# Altium project MEGA2560_Rev3e.PrjPcb
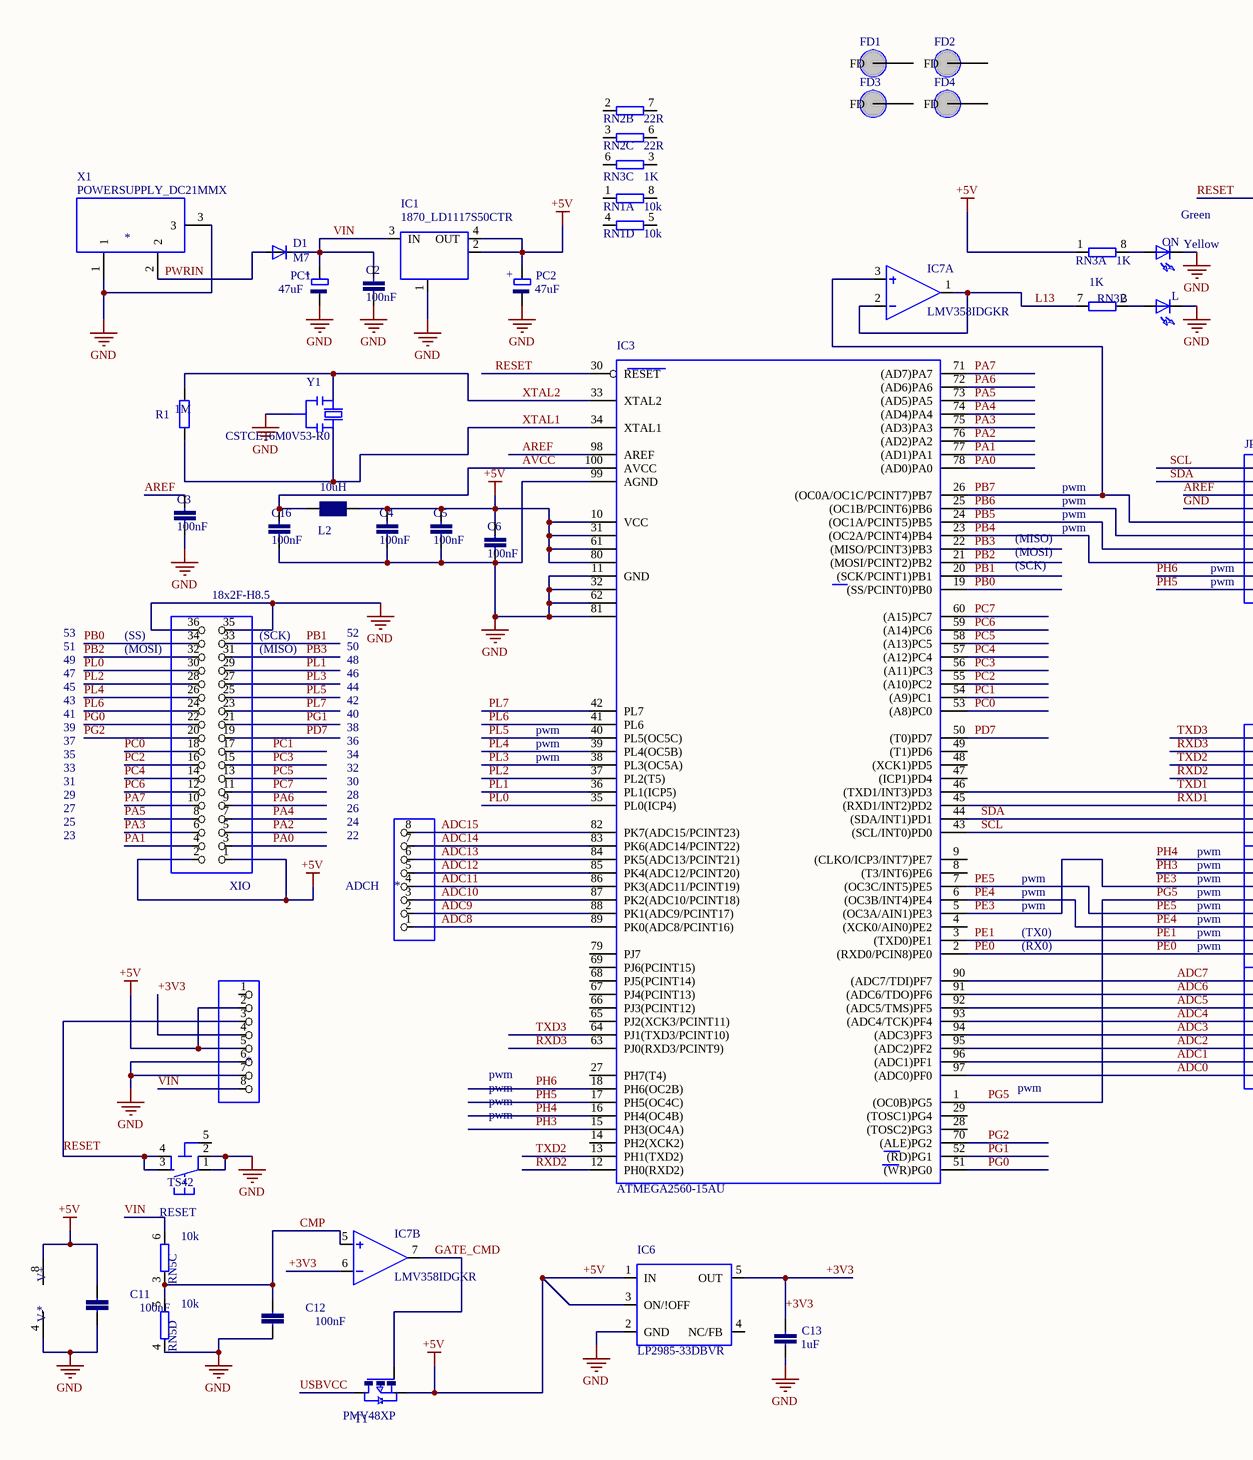
[diagram p0: MEGA2560_Rev3e_1.SchDoc, left]
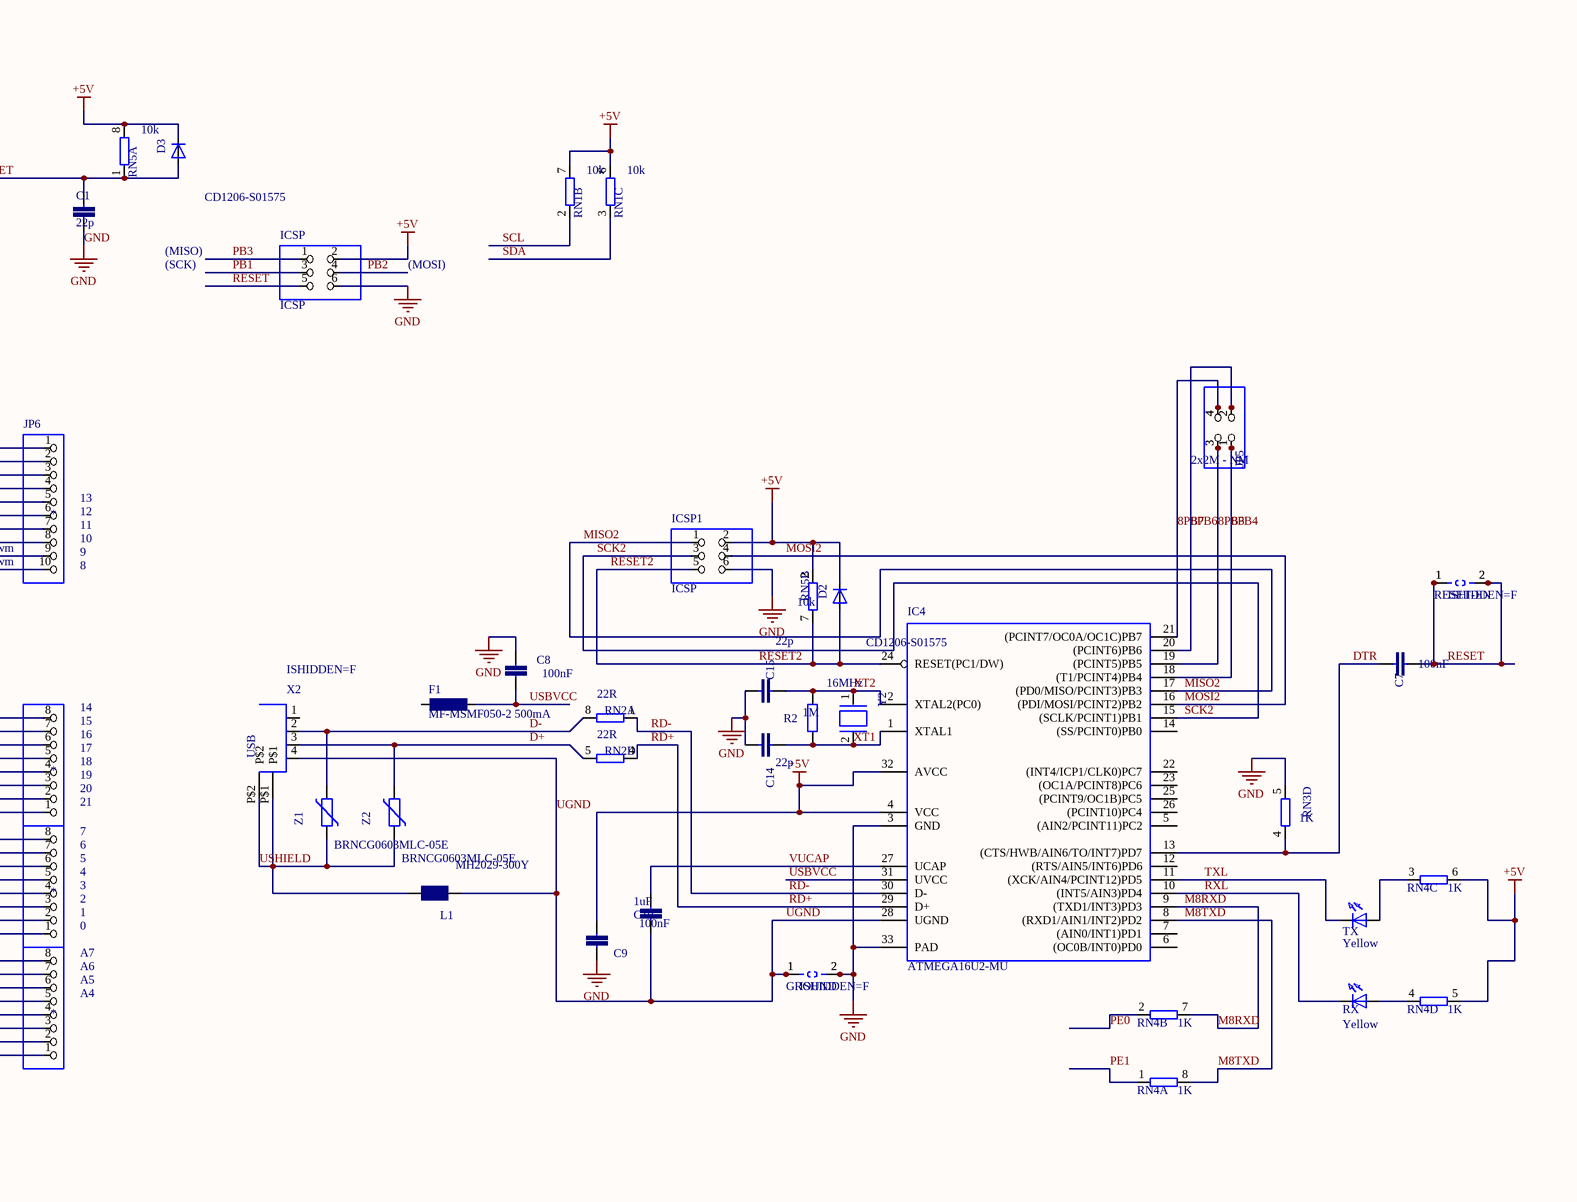
[diagram p1: MEGA2560_Rev3e_1.SchDoc, right]
1 sheet, 64 parts. Net scope: global (net labels, ports and power ports of the same name join across sheets).

## Sheet MEGA2560_Rev3e_1.SchDoc
size A2

### Parts
ADCH  *  [1X08]
ADCL  *  [1X08]
C1  22p  [C0603-ROUND]
C2  100nF  [C0603-ROUND]
C3  100nF  [C0603-ROUND]
C4  100nF  [C0603-ROUND]
C5  100nF  [C0603-ROUND]
C6  100nF  [C0603-ROUND]
C7  100nF  [C0603-ROUND]
C8  100nF  [C0603-ROUND]
C9  100nF  [C0603-ROUND]
C10  1uF  [C0603-ROUND]
C11  100nF  [C0603-ROUND]
C12  100nF  [C0603-ROUND]
C13  1uF  [C0603-ROUND]
C14  22p  [C0603-ROUND]
C15  22p  [C0603-ROUND]
C16  100nF  [C0603-ROUND]
COMMUNICATION  *  [1X08]
D1  M7  [SMB]
D2  CD1206-S01575  [MINIMELF]
D3  CD1206-S01575  [MINIMELF]
F1  MF-MSMF050-2 500mA  [L1812]
FD1  FIDUCIALMOUNT  [FIDUCIA-MOUNT]  (value not drawn)
FD2  FIDUCIALMOUNT  [FIDUCIA-MOUNT]  (value not drawn)
FD3  FIDUCIALMOUNT  [FIDUCIA-MOUNT]  (value not drawn)
FD4  FIDUCIALMOUNT  [FIDUCIA-MOUNT]  (value not drawn)
GROUND  ISHIDDEN=F  [SJ]
IC1  1870_LD1117S50CTR  [LINEAR_SOT223]
IC3  ATMEGA2560-15AU  [TQFP100]
IC4  ATMEGA16U2-MU  [MLF32]
IC6  LP2985-33DBVR  [SOT23-DBV]
IC7  LMV358IDGKR  [MSOP08]  (parts A,B,C of 3)
ICSP  ICSP  [2X03]
ICSP1  ICSP  [2X03]
JP5  2x2M - NM  [2X02]
JP6  *  [1X10]
L  Yellow  [CHIPLED_0805]
L1  MH2029-300Y  [0805]
L2  10uH  [0805]
ON  Green  [CHIPLED_0805]
PC1  47uF  [PANASONIC_D]
PC2  47uF  [PANASONIC_D]
POWER  *  [1X08]
PWML  *  [1X08]
R1  1M  [R0603-ROUND]
R2  1M  [R0603-ROUND]
RESET  TS42  [TS42]
RESET-EN  ISHIDDEN=F  [SJ]
RN1  10k  [CAY16]  (parts A,B,C,D of 4)
RN2  22R  [CAY16]  (parts A,B,C,D of 4)
RN3  1K  [CAY16]  (parts A,B,C,D of 4)
RN4  1K  [CAY16]  (parts A,B,C,D of 4)
RN5  10k  [CAY16]  (parts A,B,C,D of 4)
RX  Yellow  [CHIPLED_0805]
T1  PMV48XP  [SOT-23]
TX  Yellow  [CHIPLED_0805]
X1  *  [POWERSUPPLY_DC-21MM]
X2  ISHIDDEN=F  [PN61729]
XIO  18x2F-H8.5  [2X18]
Y1  CSTCE16M0V53-R0  [RESONATOR]
Y2  16MHz  [QS]
Z1  BRNCG0603MLC-05E  [CT/CN0603]
Z2  BRNCG0603MLC-05E  [CT/CN0603]

### Nets
+5V: C4.1 C5.1 C6.1 C9.1 C11.2 D2.C D3.C IC1.2(OUT@1) IC1.4(OUT) IC3.10(VCC) IC3.31(VCC1) IC3.61(VCC2) IC3.80(VCC3) IC4.4(VCC) IC4.32(AVCC) IC6.1(IN) IC6.3(ON/!OFF) IC7.8(V+) ICSP.2 ICSP1.2 L2.2 PC2.+ POWER.2 POWER.5 RN1.6 RN1.7 RN3.1 RN4.5 RN4.6 RN5.2 RN5.8 T1.2(S) XIO.1 XIO.2
GND: C1.2 C2.2 C3.2 C4.2 C5.2 C6.2 C8.2 C9.2 C11.1 C12.1 C13.1 C14.2 C15.2 C16.2 GROUND.2 IC1.1(GND/ADJ) IC3.11(GND) IC3.32(GND1) IC3.62(GND2) IC3.81(GND3) IC3.99(AGND) IC4.3(GND) IC4.33(PAD) IC6.2(GND) IC7.4(V-) ICSP.6 ICSP1.6 JP6.4 L.C ON.C PC1.- PC2.- POWER.6 POWER.7 RESET.1 RESET.2 RN3.5 RN5.4 X1.1 X1.3 XIO.35 XIO.36 Y1.2
8PB4: IC4.18((T1/PCINT4)PB4) JP5.1
8PB5: IC4.19((PCINT5)PB5) JP5.3
8PB6: IC4.20((PCINT6)PB6) JP5.2
8PB7: IC4.21((PCINT7/OC0A/OC1C)PB7) JP5.4
+3V3: C13.2 IC6.5(OUT) IC7.6(-IN) POWER.4
ADC0: ADCL.1 IC3.97((ADC0)PF0)
ADC1: ADCL.2 IC3.96((ADC1)PF1)
ADC2: ADCL.3 IC3.95((ADC2)PF2)
ADC3: ADCL.4 IC3.94((ADC3)PF3)
ADC4: ADCL.5 IC3.93((ADC4/TCK)PF4)
ADC5: ADCL.6 IC3.92((ADC5/TMS)PF5)
ADC6: ADCL.7 IC3.91((ADC6/TDO)PF6)
ADC7: ADCL.8 IC3.90((ADC7/TDI)PF7)
ADC8: ADCH.1 IC3.89(PK0(ADC8/PCINT16))
ADC9: ADCH.2 IC3.88(PK1(ADC9/PCINT17))
ADC10: ADCH.3 IC3.87(PK2(ADC10/PCINT18))
ADC11: ADCH.4 IC3.86(PK3(ADC11/PCINT19))
ADC12: ADCH.5 IC3.85(PK4(ADC12/PCINT20))
ADC13: ADCH.6 IC3.84(PK5(ADC13/PCINT21))
ADC14: ADCH.7 IC3.83(PK6(ADC14/PCINT22))
ADC15: ADCH.8 IC3.82(PK7(ADC15/PCINT23))
AREF: C3.1 IC3.98(AREF) JP6.3
AVCC: C16.1 IC3.100(AVCC) L2.1
CMP: C12.2 IC7.5(+IN) RN5.3 RN5.5
D+: RN2.5 X2.3 Z2.2
D-: RN2.8 X2.2 Z1.2
DTR: C7.1 IC4.13((CTS/HWB/AIN6/TO/INT7)PD7) RN3.4
GATE_CMD: IC7.7(OUT) T1.3(G)
L13: IC7.1(OUT) IC7.2(-IN) RN3.7
M8RXD: IC4.9((TXD1/INT3)PD3) RN4.7
M8TXD: IC4.8((RXD1/AIN1/INT2)PD2) RN4.8
MISO2: IC4.17((PD0/MISO/PCINT3)PB3) ICSP1.1
MOSI2: IC4.16((PDI/MOSI/PCINT2)PB2) ICSP1.4
PA0: IC3.78((AD0)PA0) XIO.3
PA1: IC3.77((AD1)PA1) XIO.4
PA2: IC3.76((AD2)PA2) XIO.5
PA3: IC3.75((AD3)PA3) XIO.6
PA4: IC3.74((AD4)PA4) XIO.7
PA5: IC3.73((AD5)PA5) XIO.8
PA6: IC3.72((AD6)PA6) XIO.9
PA7: IC3.71((AD7)PA7) XIO.10
PB0: IC3.19((SS/PCINT0)PB0) XIO.34
PB1: IC3.20((SCK/PCINT1)PB1) ICSP.3 XIO.33
PB2: IC3.21((MOSI/PCINT2)PB2) ICSP.4 XIO.32
PB3: IC3.22((MISO/PCINT3)PB3) ICSP.1 XIO.31
PB4: IC3.23((OC2A/PCINT4)PB4) JP6.8
PB5: IC3.24((OC1A/PCINT5)PB5) JP6.7
PB6: IC3.25((OC1B/PCINT6)PB6) JP6.6
PB7: IC3.26((OC0A/OC1C/PCINT7)PB7) IC7.3(+IN) JP6.5
PC0: IC3.53((A8)PC0) XIO.18
PC1: IC3.54((A9)PC1) XIO.17
PC2: IC3.55((A10)PC2) XIO.16
PC3: IC3.56((A11)PC3) XIO.15
PC4: IC3.57((A12)PC4) XIO.14
PC5: IC3.58((A13)PC5) XIO.13
PC6: IC3.59((A14)PC6) XIO.12
PC7: IC3.60((A15)PC7) XIO.11
PD7: IC3.50((T0)PD7) XIO.19
PE0: IC3.2((RXD0/PCIN8)PE0) PWML.1 RN4.2
PE1: IC3.3((TXD0)PE1) PWML.2 RN4.1
PE3: IC3.5((OC3A/AIN1)PE3) PWML.6
PE4: IC3.6((OC3B/INT4)PE4) PWML.3
PE5: IC3.7((OC3C/INT5)PE5) PWML.4
PG0: IC3.51((WR)PG0) XIO.22
PG1: IC3.52((RD)PG1) XIO.21
PG2: IC3.70((ALE)PG2) XIO.20
PG5: IC3.1((OC0B)PG5) PWML.5
PH3: IC3.15(PH3(OC4A)) PWML.7
PH4: IC3.16(PH4(OC4B)) PWML.8
PH5: IC3.17(PH5(OC4C)) JP6.10
PH6: IC3.18(PH6(OC2B)) JP6.9
PL0: IC3.35(PL0(ICP4)) XIO.30
PL1: IC3.36(PL1(ICP5)) XIO.29
PL2: IC3.37(PL2(T5)) XIO.28
PL3: IC3.38(PL3(OC5A)) XIO.27
PL4: IC3.39(PL4(OC5B)) XIO.26
PL5: IC3.40(PL5(OC5C)) XIO.25
PL6: IC3.41(PL6) XIO.24
PL7: IC3.42(PL7) XIO.23
PWRIN: D1.A X1.2
RD+: IC4.29(D+) RN2.4
RD-: IC4.30(D-) RN2.1
RESET: C1.1 C7.2 D3.A IC3.30(RESET) ICSP.5 POWER.3 RESET.3 RESET.4 RESET-EN.1 RESET-EN.2 RN5.1
RESET2: D2.A IC4.24(RESET(PC1/DW)) ICSP1.5 RN5.7
RXD1: COMMUNICATION.3 IC3.45((RXD1/INT2)PD2)
RXD2: COMMUNICATION.5 IC3.12(PH0(RXD2))
RXD3: COMMUNICATION.7 IC3.63(PJ0(RXD3/PCINT9))
RXL: IC4.10((INT5/AIN3)PD4) RX.C
SCK2: IC4.15((SCLK/PCINT1)PB1) ICSP1.3
SCL: COMMUNICATION.1 IC3.43((SCL/INT0)PD0) JP6.1 RN1.2
SDA: COMMUNICATION.2 IC3.44((SDA/INT1)PD1) JP6.2 RN1.3
TXD1: COMMUNICATION.4 IC3.46((TXD1/INT3)PD3)
TXD2: COMMUNICATION.6 IC3.13(PH1(TXD2))
TXD3: COMMUNICATION.8 IC3.64(PJ1(TXD3/PCINT10))
TXL: IC4.11((XCK/AIN4/PCINT12)PD5) TX.C
UGND: C10.2 GROUND.1 IC4.28(UGND) L1.1 X2.4
USBVCC: C8.1 F1.1 IC4.31(UVCC) T1.1(D)
USHIELD: L1.2 X2.P$1 X2.P$2 Z1.1 Z2.1
VIN: C2.1 D1.C IC1.3(IN) PC1.+ POWER.8 RN5.6
VUCAP: C10.1 IC4.27(UCAP)
XT1: C14.1 IC4.1(XTAL1) R2.1 Y2.2
XT2: C15.1 IC4.2(XTAL2(PC0)) R2.2 Y2.1
XTAL1: IC3.34(XTAL1) R1.1 Y1.3
XTAL2: IC3.33(XTAL2) R1.2 Y1.1
NetL_A: L.A RN3.2
NetON_A: ON.A RN3.8
NetRN4_3: RN4.3 TX.A
NetRN4_4: RN4.4 RX.A

Not connected (* = marked no-connect by the designer): F1 2; FD1 ?1(FD); FD2 ?1(FD); FD3 ?1(FD); FD4 ?1(FD); IC3 4((XCK0/AIN0)PE2) 8((T3/INT6)PE6) 9((CLKO/ICP3/INT7)PE7) 14(PH2(XCK2)) 27(PH7(T4)) 28((TOSC2)PG3) 29((TOSC1)PG4) 47((ICP1)PD4) 48((XCK1)PD5) 49((T1)PD6) 65(PJ2(XCK3/PCINT11)) 66(PJ3(PCINT12)) 67(PJ4(PCINT13)) 68(PJ5(PCINT14)) 69(PJ6(PCINT15)) 79(PJ7); IC4 5((AIN2/PCINT11)PC2) 6((OC0B/INT0)PD0) 7((AIN0/INT1)PD1) 12((RTS/AIN5/INT6)PD6) 14((SS/PCINT0)PB0) 22((INT4/ICP1/CLK0)PC7) 23((OC1A/PCINT8)PC6) 25((PCINT9/OC1B)PC5) 26((PCINT10)PC4); IC6 4(NC/FB); POWER 1; RESET 5(5-GND); RN1 1 4(1) 5(2) 8(2); RN2 2(1) 3(1) 6(2) 7(2); RN3 3(1) 6(2); X2 1

### Notes on the sheet
- (SCK)
- (MISO)
- (MOSI)
- pwm
- (near JP6) 12
- (near JP6) 13
- (near JP6) pwm
- (near JP6) 8
- (near JP6) 9
- (near JP6) 10
- (near JP6) 11
- 51
- 53
- 49
- (SS)
- (near XIO) (MOSI)
- (near XIO) (SCK)
- (near XIO) (MISO)
- 52
- 50
- 48
- 47
- 45
- 43
- 41
- 39
- 46
- 44
- 42
- 40
- 38
- (near COMMUNICATION) 14
- 29
- 31
- 33
- 35
- 37
- (near ADCH) 28
- 30
- 32
- 34
- 36
- (near COMMUNICATION) 15
- (near COMMUNICATION) 16
- (near COMMUNICATION) 17
- (near COMMUNICATION) 18
- (near COMMUNICATION) 19
- 23
- 25
- 27
- (near ADCH) 22
- (near ADCH) 24
- (near ADCH) 26
- 6
- 7
- (near COMMUNICATION) 20
- 21
- (TX0)
- (near PWML) 1
- (near PWML) 2
- (near PWML) 3
- (near PWML) 4
- (near PWML) 5
- (RX0)
- 0
- A7
- A6
- (near ADCL) A5
- (near ADCL) A4
- (in symbol 0056_USB-B-S-RA-WT-SPCC) USB

### Library data of the parts
ADCH ADCL COMMUNICATION = 0058_FH254-108DF08500V
C1 C14 C15 = 0014_22PF_0603
C2-C9 C11 C12 C16 = 0015_100NF_0603
C10 C13 = 0006_1UF_0603/GRM188R61E105KA12D
D1 = 0020_M7
D2 D3 = 0012_CD1206-S01575
F1 = 0002_MF-MSMF050-2
GROUND RESET-EN = SJ
IC3 = 0023_ATMEGA2560-16AU
IC4 = 0007_ATMEGA16U2-MUR
IC6 = 0008_TEXLP2985-33DBVR
IC7 = 0021_LMV358IDGKR
ICSP ICSP1 = 0114_PH254-203DF118A00V
JP5 = PINHD-2X2
JP6 = 1216_FH254-110DF08500T30
L RX TX = 0044_KPT-2012YC
L1 = 0001_BLM21PG300SN1D_/_MH2029-300Y
L2 = 0715_CV201210-100K
ON = 0043_KPT-2012SGC
PC1 PC2 = 0113_47UF
POWER = 1217_FH254-108DF08500T21
PWML = 1218_FH254-108DF08500T20
R1 R2 = 0004_0603_1M
RESET = 0946_TS42031-160W-TR-7260
RN1 RN5 = 0016_064R_10K_/_CAY16-103J4LF
RN2 = 0003_064R_22R_/_CAY16-220J4LF
RN3 RN4 = 0005_064R_1K_/_CAY16-102J4LF
T1 = 0297_PMV48XP
X1 = POWERSUPPLY_DC21MMX
X2 = 0056_USB-B-S-RA-WT-SPCC
XIO = 0060_FH254-218DF08500V
Y1 = 0011_CSTCE16M0V53-R0
Y2 = 0019_P011052006_16M
Z1 Z2 = 0010_BRNCG0603MLC-05E